# Altium schematic sheet Sample_Seqencer.SchDoc
size A; DocumentNumber: 4; SheetNumber: 4; SheetTotal: 4
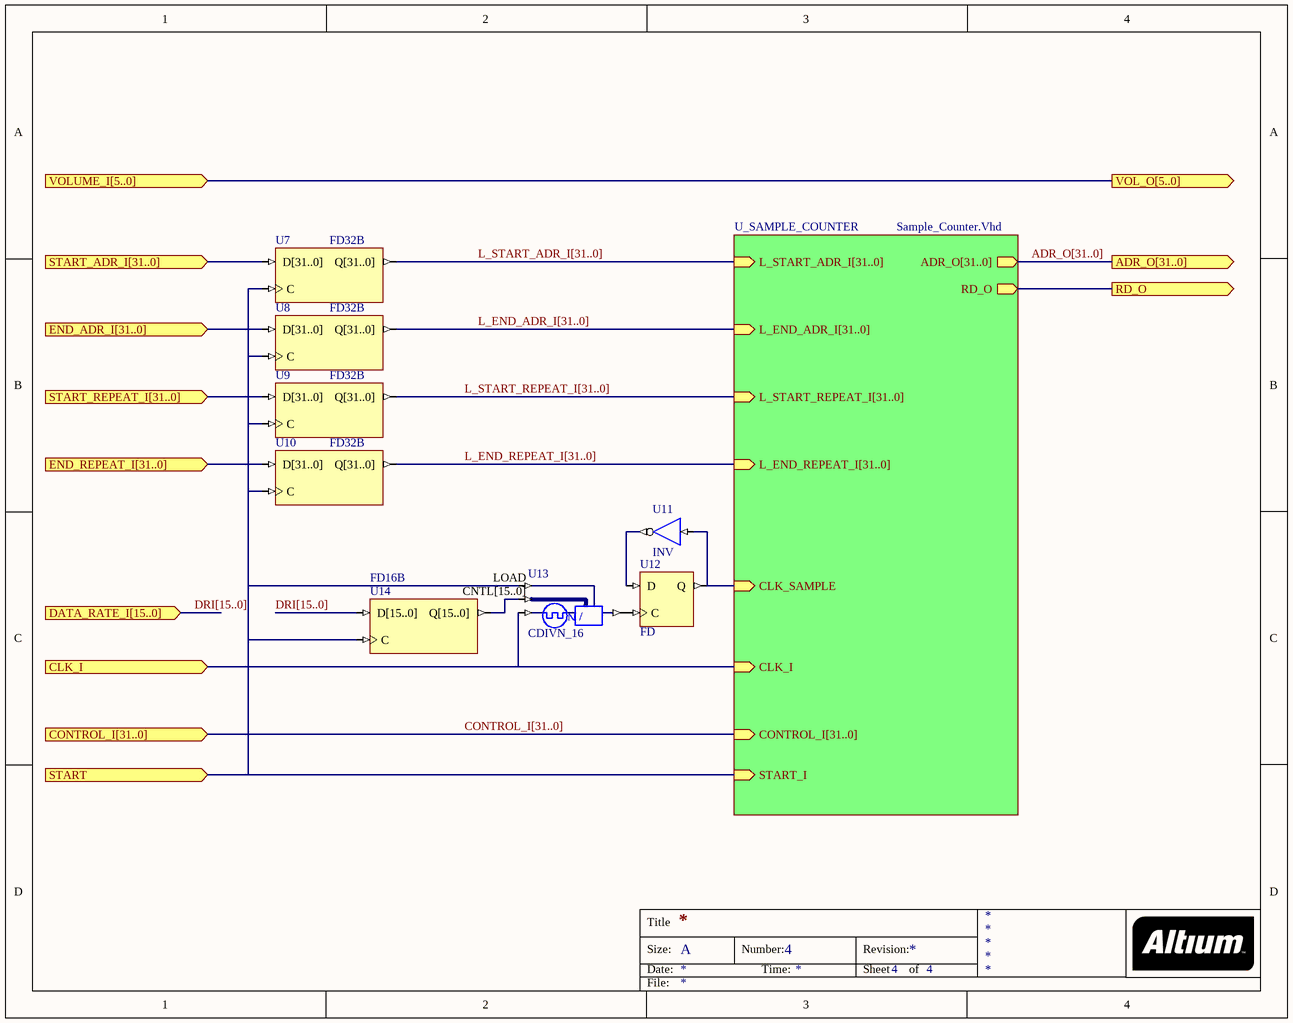
[diagram p0: Sample_Seqencer.SchDoc]

## Parts
U7  FD32B
U8  FD32B
U9  FD32B
U10  FD32B
U11  INV
U12  FD
U13  CDIVN_16
U14  FD16B

## Sub-sheets
U_SAMPLE_COUNTER = Sample_Counter.Vhd: RD_O (out), ADR_O[31..0] (out), L_START_ADR_I[31..0] (in), L_END_ADR_I[31..0] (in), L_START_REPEAT_I[31..0] (in), L_END_REPEAT_I[31..0] (in), CONTROL_I[31..0] (in), CLK_SAMPLE (in), CLK_I (in), START_I (in)

## Ports
ADR_O[31..0] (out), CLK_I (in), CONTROL_I[31..0] (in), DATA_RATE_I[15..0] (in), END_ADR_I[31..0] (in), END_REPEAT_I[31..0] (in), RD_O (out), START (in), START_ADR_I[31..0] (in), START_REPEAT_I[31..0] (in), VOL_O[5..0] (out), VOLUME_I[5..0] (in)

## Nets
CLK_I: U13.CLKIN ; port CLK_I, sheet U_SAMPLE_COUNTER/CLK_I
DRI[15..0]: U14.D[15..0] ; port DATA_RATE_I[15..0]
END_ADR_I[31..0]: U8.D[31..0] ; port END_ADR_I[31..0]
END_REPEAT_I[31..0]: U10.D[31..0] ; port END_REPEAT_I[31..0]
L_END_ADR_I[31..0]: U8.Q[31..0] ; sheet U_SAMPLE_COUNTER/L_END_ADR_I[31..0]
L_END_REPEAT_I[31..0]: U10.Q[31..0] ; sheet U_SAMPLE_COUNTER/L_END_REPEAT_I[31..0]
L_START_ADR_I[31..0]: U7.Q[31..0] ; sheet U_SAMPLE_COUNTER/L_START_ADR_I[31..0]
L_START_REPEAT_I[31..0]: U9.Q[31..0] ; sheet U_SAMPLE_COUNTER/L_START_REPEAT_I[31..0]
RD_O: port RD_O, sheet U_SAMPLE_COUNTER/RD_O
START: U7.C U8.C U9.C U10.C U13.LOAD U14.C ; port START, sheet U_SAMPLE_COUNTER/START_I
START_ADR_I[31..0]: U7.D[31..0] ; port START_ADR_I[31..0]
START_REPEAT_I[31..0]: U9.D[31..0] ; port START_REPEAT_I[31..0]
NetU11_I: U11.I U12.Q ; sheet U_SAMPLE_COUNTER/CLK_SAMPLE
NetU11_O: U11.O U12.D
NetU12_C: U12.C U13.CLKDV
NetU13_CNTL[15..0]: U13.CNTL[15..0] U14.Q[15..0]

## Buses and harness runs
bus ADR_O[31..0] = port ADR_O[31..0] = sheet U_SAMPLE_COUNTER/ADR_O[31..0]
bus CONTROL_I[31..0] = port CONTROL_I[31..0] = sheet U_SAMPLE_COUNTER/CONTROL_I[31..0]
bus DRI[15..0]
bus DRI[15..0] = port DATA_RATE_I[15..0]
bus L_END_ADR_I[31..0] = sheet U_SAMPLE_COUNTER/L_END_ADR_I[31..0]
bus L_END_REPEAT_I[31..0] = sheet U_SAMPLE_COUNTER/L_END_REPEAT_I[31..0]
bus L_START_ADR_I[31..0] = sheet U_SAMPLE_COUNTER/L_START_ADR_I[31..0]
bus L_START_REPEAT_I[31..0] = sheet U_SAMPLE_COUNTER/L_START_REPEAT_I[31..0]
bus port VOL_O[5..0] = port VOLUME_I[5..0]

## Notes on the sheet
- Title
- Size:
- Date:
- A
- Number:
- Time:
- Revision:
- Sheet
- of
- File:
- (in symbol CDIVN_16) / N

## Library data of the parts
U7-U10 = FD32B: 32-Bit D-Type Flip-Flop, Bus Version; SubClass: FD; ClockTrigger: Rising; PortSize: 32; ArchiveName: GENERIC; VHDLIB_SIM: GENERIC_LIB; Published: 31-May-2004; Publisher: Altium Limited; LastRevisionNo: 1.00.00; HelpURL: CR0118 FPGA Generic Library Guide.pdf#page=169; FunctionalClass: Flip-Flop; PortStyle: Bus Version; ComponentLink1Description: Core &Resource Usage; ComponentLink1URL: CR0133 FPGA Flip Flop Resource Usage.pdf#page=133
U11 = INV: Inverter; FunctionalClass: Logic Primitive; ArchiveName: GENERIC; VHDLIB_SIM: GENERIC_LIB; Published: 29-Jan-2004; Publisher: Altium Limited; XilinxEquivalent: INV; LastRevisionNo: 1.00.00; HelpURL: CR0118 FPGA Generic Library Guide.pdf#page=290; ComponentLink1URL: CR0136 FPGA Logic Primitive Resource Usage.pdf#page=61; ComponentLink1Description: Core &Resource Usage; SubClass: INV
U12 = FD: D-Type Flip-Flop; ClockTrigger: Rising; ArchiveName: GENERIC; VHDLIB_SIM: GENERIC_LIB; Published: 29-Jan-2004; Publisher: Altium Limited; XilinxEquivalent: FD; LastRevisionNo: 1.00.00; HelpURL: CR0118 FPGA Generic Library Guide.pdf#page=169; ComponentLink1URL: CR0133 FPGA Flip Flop Resource Usage.pdf#page=4; ComponentLink1Description: Core &Resource Usage; FunctionalClass: Flip-Flop; SubClass: FD
U13 = CDIVN_16: 16-Bit Programmable Clock Divider; ArchiveName: GENERIC; VHDLIB_SIM: GENERIC_LIB; PortSize: 16; Published: 29-Jan-2004; Publisher: Altium Limited; LastRevisionNo: 1.00.00; HelpURL: CR0118 FPGA Generic Library Guide.pdf#page=143; FunctionalClass: Clock Divider; DivisorRate: Programmable; ComponentLink1URL: CR0127 FPGA Clock Divider Resource Usage.pdf#page=33; ComponentLink1Description: Core &Resource Usage
U14 = FD16B: 16-Bit D-Type Flip-Flop, Bus Version; SubClass: FD; ClockTrigger: Rising; PortSize: 16; ArchiveName: GENERIC; VHDLIB_SIM: GENERIC_LIB; Published: 29-Jan-2004; Publisher: Altium Limited; LastRevisionNo: 1.00.00; HelpURL: CR0118 FPGA Generic Library Guide.pdf#page=169; FunctionalClass: Flip-Flop; PortStyle: Bus Version; ComponentLink1URL: CR0133 FPGA Flip Flop Resource Usage.pdf#page=101; ComponentLink1Description: Core &Resource Usage